# Altium schematic sheet cs301_Group_12.SchDoc
size B; SheetNumber: 1; SheetTotal: 2
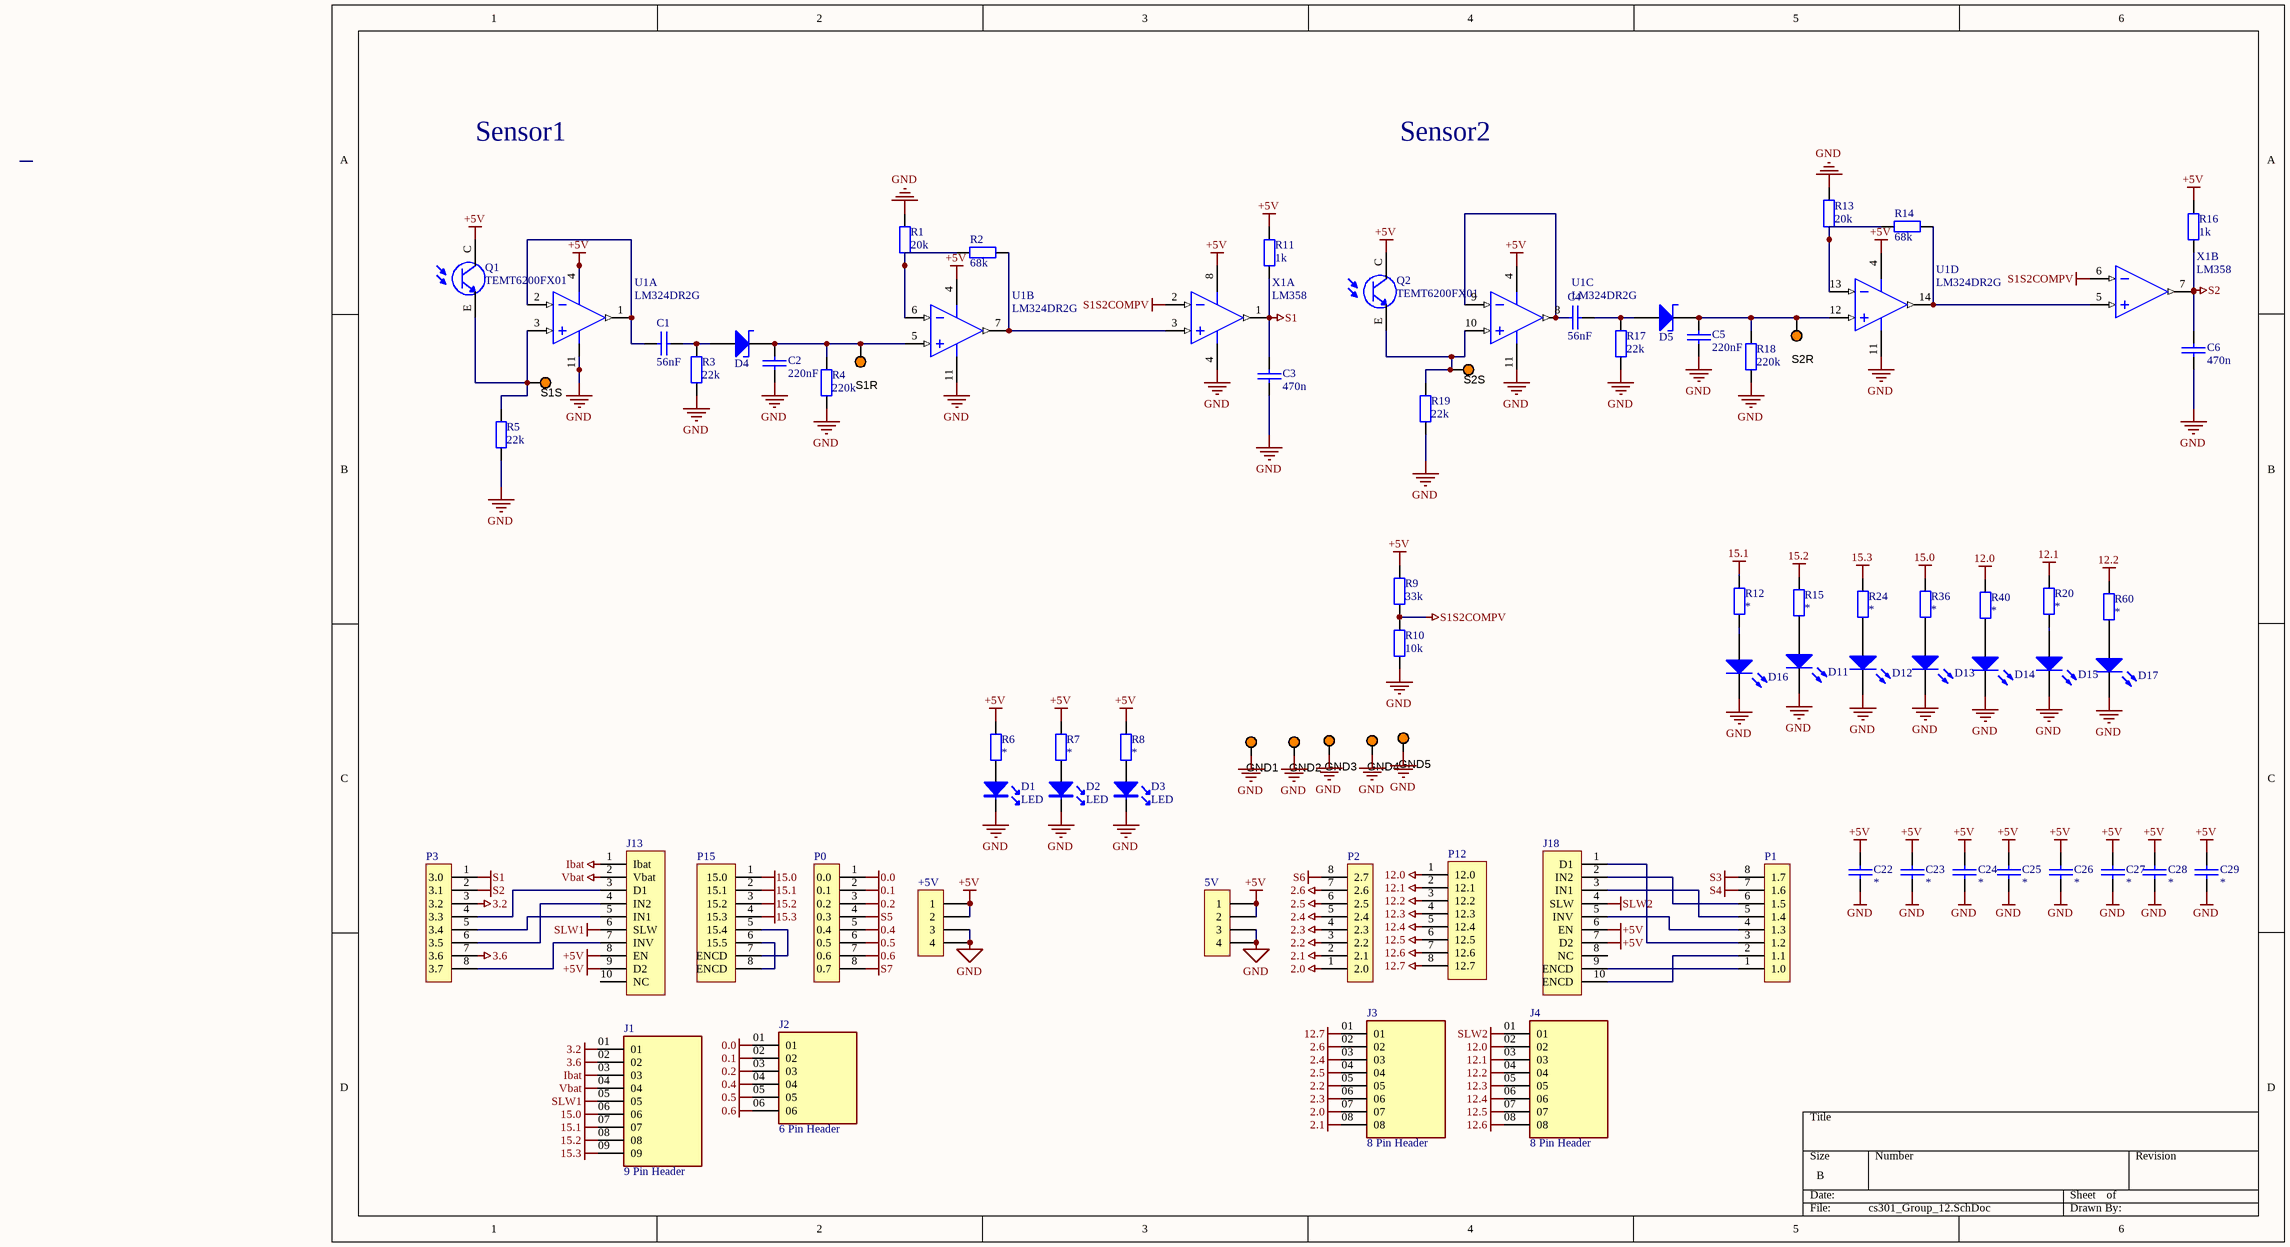
[diagram p0: cs301_Group_12.SchDoc]

## Parts
5V  5V  [IDC4]  (value not drawn)
+5V  5V  [IDC4]  (value not drawn)
C1  56nF  [0805 CAP]
C2  220nF  [0805 CAP]
C3  470n  [0805 CAP]
C4  56nF  [0805 CAP]
C5  220nF  [0805 CAP]
C6  470n  [0805 CAP]
C22  *  [0805 CAP]
C23  *  [0805 CAP]
C24  *  [0805 CAP]
C25  *  [0805 CAP]
C26  *  [0805 CAP]
C27  *  [0805 CAP]
C28  *  [0805 CAP]
C29  *  [0805 CAP]
D1  LED  [LED0.1/5MM]
D2  LED  [LED0.1/5MM]
D3  LED  [LED0.1/5MM]
D4  BZT52H-B4V7  [SOD123]  (value not drawn)
D5  BZT52H-B4V7  [SOD123]  (value not drawn)
D11  LTST-C170KGKT  [0805 LED]  (value not drawn)
D12  LTST-C170KGKT  [0805 LED]  (value not drawn)
D13  LTST-C170KGKT  [0805 LED]  (value not drawn)
D14  LTST-C170KGKT  [0805 LED]  (value not drawn)
D15  LTST-C170KGKT  [0805 LED]  (value not drawn)
D16  LTST-C170KGKT  [0805 LED]  (value not drawn)
D17  LTST-C170KGKT  [0805 LED]  (value not drawn)
GND1  5003  [TP_TH]  (value not drawn)
GND2  5003  [TP_TH]  (value not drawn)
GND3  5003  [TP_TH]  (value not drawn)
GND4  5003  [TP_TH]  (value not drawn)
GND5  5003  [TP_TH]  (value not drawn)
J1  9 Pin Header  [SAMTEC_MTSW-109-22-G-S-440]
J2  6 Pin Header  [SAMTEC_TSW-106-07-H-S]
J3  8 Pin Header  [SAMTEC_TSW-108-05-F-S]
J4  8 Pin Header  [SAMTEC_TSW-108-05-F-S]
J13  CON10  [idc10]  (value not drawn)
J18  CON10  [IDC10]  (value not drawn)
P0  P0  [idc8]  (value not drawn)
P1  P1  [idc8]  (value not drawn)
P2  P2  [idc8]  (value not drawn)
P3  P3  [idc8]  (value not drawn)
P12  P12  [idc8]  (value not drawn)
P15  P15  [idc8]  (value not drawn)
Q1  TEMT6200FX01  [XDCR_TEMT6200FX01]
Q2  TEMT6200FX01  [XDCR_TEMT6200FX01]
R1  20k  [0805 RES]
R2  68k  [0805 RES]
R3  22k  [0805 RES]
R4  220k  [0805 RES]
R5  22k  [0805 RES]
R6  *  [0805 RES]
R7  *  [0805 RES]
R8  *  [0805 RES]
R9  33k  [0805 RES]
R10  10k  [0805 RES]
R11  1k  [0805 RES]
R12  *  [0805 RES]
R13  20k  [0805 RES]
R14  68k  [0805 RES]
R15  *  [0805 RES]
R16  1k  [0805 RES]
R17  22k  [0805 RES]
R18  220k  [0805 RES]
R19  22k  [0805 RES]
R20  *  [0805 RES]
R24  *  [0805 RES]
R36  *  [0805 RES]
R40  *  [0805 RES]
R60  *  [0805 RES]
S1R  5003  [TP_TH]  (value not drawn)
S1S  5003  [TP_TH]  (value not drawn)
S2R  5003  [TP_TH]  (value not drawn)
S2S  5003  [TP_TH]  (value not drawn)
U1  LM324DR2G  [SOIC-14]  (parts A,B,C,D of 4)
X1  LM358  [SO - 8]  (parts A,B of 2)

## Nets
0.0: J2.01 P0.1(0.0)
0.1: J2.02 P0.2(0.1)
0.2: J2.03 P0.3(0.2)
0.4: J2.04 P0.5(0.4)
0.5: J2.05 P0.6(0.5)
0.6: J2.06 P0.7(0.6)
2.0: J3.07 P2.1(2.0)
2.1: J3.08 P2.2(2.1)
2.2: J3.05 P2.3(2.2)
2.3: J3.06 P2.4(2.3)
2.4: J3.03 P2.5(2.4)
2.5: J3.04 P2.6(2.5)
2.6: J3.02 P2.7(2.6)
3.2: J1.01 P3.3(3.2)
3.6: J1.02 P3.7(3.6)
12.0: J4.02 P12.1(12.0) R40.2
12.1: J4.03 P12.2(12.1) R20.2
12.2: J4.04 P12.3(12.2) R60.2
12.3: J4.05 P12.4(12.3)
12.4: J4.06 P12.5(12.4)
12.5: J4.07 P12.6(12.5)
12.6: J4.08 P12.7(12.6)
12.7: J3.01 P12.8(12.7)
15.0: J1.06 P15.1(15.0) R36.2
15.1: J1.07 P15.2(15.1) R12.2
15.2: J1.08 P15.3(15.2) R15.2
15.3: J1.09 P15.4(15.3) R24.2
+5V: 5V.1 5V.2 +5V.1 +5V.2 C22.1 C23.1 C24.1 C25.1 C26.1 C27.1 C28.1 C29.1 J13.8(EN) J13.9(D2) J18.6(EN) J18.7(D2) Q1.C Q2.C R6.2 R7.2 R8.2 R9.1 R11.1 R16.1 U1.4(VCC) X1.8(VDD)
GND: 5V.3 5V.4 +5V.3 +5V.4 C2.2 C3.2 C5.2 C6.2 C22.2 C23.2 C24.2 C25.2 C26.2 C27.2 C28.2 C29.2 D1.K D2.K D3.K D11.2(K) D12.2(K) D13.2(K) D14.2(K) D15.2(K) D16.2(K) D17.2(K) R1.2 R3.1 R4.1 R5.1 R10.2 R13.2 R17.1 R18.1 R19.1 U1.11(VEE/GND) X1.4(VSS)
Ibat: J1.03 J13.1(Ibat)
S1: C3.1 P3.1(3.0) R11.2 X1.1(VOUTA)
S1S2COMPV: R9.2 R10.1 X1.2(VINA-) X1.6(VINA-)
S2: C6.1 P3.2(3.1) R16.2 X1.7(VOUTA)
S3: P1.8(1.7)
S4: P1.7(1.6)
S5: P0.4(0.3)
S6: P2.8(2.7)
S7: P0.8(0.7)
SLW1: J1.05 J13.6(SLW)
SLW2: J4.01 J18.4(SLW)
Vbat: J1.04 J13.2(Vbat)
NetC1_1: C1.1 U1.1(OUT1) U1.2(IN1-)
NetC1_2: C1.2 D4.1(A) R3.2
NetC2_1: C2.1 D4.2(K) R4.2 S1R.1 U1.5(IN2+)
NetC4_1: C4.1 U1.8(OUT3) U1.9(IN3-)
NetC4_2: C4.2 D5.1(A) R17.2
NetC5_1: C5.1 D5.2(K) R18.2 S2R.1 U1.12(IN4+)
NetD1_A: D1.A R6.1
NetD2_A: D2.A R7.1
NetD3_A: D3.A R8.1
NetD11_1: D11.1(A) R15.1
NetD12_1: D12.1(A) R24.1
NetD13_1: D13.1(A) R36.1
NetD14_1: D14.1(A) R40.1
NetD15_1: D15.1(A) R20.1
NetD16_1: D16.1(A) R12.1
NetD17_1: D17.1(A) R60.1
NetJ13_3: J13.3(D1) P3.4(3.3)
NetJ13_4: J13.4(IN2) P3.6(3.5)
NetJ13_5: J13.5(IN1) P3.5(3.4)
NetJ13_7: J13.7(INV) P3.8(3.7)
NetJ18_1: J18.1(D1) P1.3(1.2)
NetJ18_2: J18.2(IN2) P1.6(1.5)
NetJ18_3: J18.3(IN1) P1.5(1.4)
NetJ18_5: J18.5(INV) P1.4(1.3)
NetJ18_9: J18.9(ENCD) P1.1(1.0)
NetJ18_10: J18.10(ENCD) P1.2(1.1)
NetP15_5: P15.5(15.4) P15.7(ENCD)
NetP15_6: P15.6(15.5) P15.8(ENCD)
NetQ1_E: Q1.E R5.2 S1S.1 U1.3(IN1+)
NetQ2_E: Q2.E R19.2 S2S.1 U1.10(IN3+)
NetR1_1: R1.1 R2.2 U1.6(IN2-)
NetR2_1: R2.1 U1.7(OUT2) X1.3(VINA+)
NetR13_1: R13.1 R14.2 U1.13(IN4-)
NetR14_1: R14.1 U1.14(OUT4) X1.5(VINA+)

Not connected (* = marked no-connect by the designer): GND1 1; GND2 1; GND3 1; GND4 1; GND5 1; J13 10(NC); J18 8(NC)

## Notes on the sheet
- Sensor1
- Sensor2
- Labels drawn without touching a wire or pin: GND

## Library data of the parts
5V +5V = CON4: Connector
C1-C6 C22-C29 = CerCap_SMT_0805: SMT ceramic capacitor 0805 size; Value: *
D4 D5 = Zener_SMT_SOD123: SMT zener diode with SOD123 package; Manufacturer: Nexperia USA Inc.; Manufacturer Part Number: BZT52H-B4V7,115; Tolerance: ±2%; Supplier 1: Digi-Key; RoHS: RoHS Compliant; Category: Discrete Semiconductor Products; Stock 1: 0; Pricing 1: 1=0.51, 10=0.408, 100=0.2164, 500=0.14232, 1000=0.09678 (NZD); Packaging: Cut Tape (CT); Part Status: Active; Operating Temperature: -65°C ~ 150°C (TA); Mounting Type: Surface Mount; Package / Case: SOD-123F; Supplier Device Package: SOD-123F; ComponentLink1URL: https://assets.nexperia.com/documents/data-sheet/BZT52H_SER.pdf; ComponentLink1Description: https://assets.nexperia.com/documents/data-sheet/BZT52H_SER.pdf; Supplier Part Number 1: 1727-1611-1-ND
D11-D17 = LED_SMT_0805: SMT LED 0805 size; Manufacturer: Lite-On Inc.; Color: Green; Lens Color: Colorless; Lens Transparency: Clear; Millicandela Rating: 35mcd; Lens Style/Size: Rectangle with Flat Top, 1.40mm x 1.25mm; Voltage - Forward (Vf) (Typ): 2V; Current - Test: 20mA; Viewing Angle: 130°; Wavelength - Dominant: 571nm; Wavelength - Peak: 574nm; Supplier 1: Digi-Key; Manufacturer Part Number: LTST-C170KGKT; RoHS: RoHS Compliant; Category: Optoelectronics; Stock 1: 503069; Pricing 1: 1=0.62, 10=0.459, 25=0.338, 100=0.2415, 250=0.16416, 500=0.14486, 1000=0.11347 (NZD); Packaging: Cut Tape (CT); Part Status: Active; Mounting Type: Surface Mount; Features: -; Package / Case: 0805 (2012 Metric); Size / Dimension: 2.00mm L x 1.25mm W; Height (Max): 1.10mm; ComponentLink1URL: http://optoelectronics.liteon.com/upload/download/DS22-2000-073/LTST-C170KGKT.pdf; ComponentLink1Description: http://optoelectronics.liteon.com/upload/download/DS22-2000-073/LTST-C170KGKT.pdf; Supplier Part Number 1: 160-1414-1-ND
GND1-GND5 S1R S1S S2R S2S = TestPoint: Test Point, Orange, 1-Pin THD, RoHS; Peak Reverse Current: 600 uA; Forward Current: 3 A; Max Surge Current: 80 A; Forward Voltage: 1.08 V; Max Operating Temperature: 150 degC; PackageReference: 5003; Pins: 2; ComponentLink2URL: http://keyelco.com/userAssets/file/M65p56.pdf; PackageDescription: 1-Pin Through Hole Device, Dia 2.54 mm; Weight: 0.01 lb; Diameter: 5.3 mm; Mount: Through Hole; Package Quantity: 500; Packaging: Bulk; Min Operating Temperature: -65 degC; ComponentLink1Description: Manufacturer URL; Height: 0.25 inch; ComponentLink1URL: http://www.keyelco.com/; ComponentLink2Description: Datasheet; Width: 0.25 inch; REACH SVHC: No SVHC; RoHSCompliant: true; Radiation Hardening: No; Length: 9.5 mm; DatasheetVersion: Jun-15
J1 = MTSW-109-22-G-S-440: MP: MTSW-109-22-G-S-440; Availability: Unavailable; Package: None; Price: None; Value: *
J2 = TSW-106-07-H-S: Connector Header Through Hole 6 position 0.100 (2.54mm); MF: Samtec; Value: *; MP: TSW-106-07-H-S; Package: None; Purchase-URL: https://pricing.snapeda.com/search/part/TSW-106-07-H-S/?ref=eda; Availability: In Stock; Check_prices: https://www.snapeda.com/parts/TSW-106-07-H-S/Samtec/view-part/?ref=eda; SnapEDA_Link: https://www.snapeda.com/parts/TSW-106-07-H-S/Samtec/view-part/?ref=snap; Price: None
J3 J4 = TSW-108-05-F-S: Package: None; Price: None; Value: *; MP: TSW-108-05-F-S; Availability: Unavailable
J13 J18 = CON10: Connector
P0-P3 = CON8: Connector
P12 P15 = CON8_1: Connector
Q1 Q2 = TEMT6200FX01: Phototransistors 550nm Top View 0805 (2012 Metric); MF: Vishay Semiconductor; Price: None; Package: 0805 Vishay Semiconductor; Check_prices: https://www.snapeda.com/parts/TEMT6200FX01/Vishay%20Semiconductor%20Opto%20Division/view-part/43955/?ref=eda; Purchase-URL: https://pricing.snapeda.com/search/part/TEMT6200FX01/?ref=eda; MP: TEMT6200FX01; Value: *; SnapEDA_Link: https://www.snapeda.com/parts/TEMT6200FX01/Vishay%20Semiconductor%20Opto%20Division/view-part/43955/?ref=snap; Availability: Good
R1-R20 R24 R36 R40 R60 = Res_SMT_0805: 0805 resistor; Published: 8-Jun-2000; LatestRevisionDate: 17-Jul-2002; LatestRevisionNote: Re-released for DXP Platform.; PackageReference: AXIAL-0.4; Publisher: Altium Limited; Value: *; ComponentLink1Description: https://nz.mouser.com/datasheet/2/315/AOA0000C304-1149620.pdf
U1 = LM324DR_SMT_SOIC16: Single Supply Quad Operational Amplifier, 3 to 32 V, 0 to 70 degC, 14-Pin SOIC, Pb-Free, Tape and Reel; Manufacturer: On Semiconductor; VCC Max (V): 32; VCC Min (V): 3; PackageVersion: Rev. K, 05/2011; ComponentLink3URL: http://www.onsemi.com/pub_link/Collateral/751A-03.PDF; ComponentLink3Description: Package Specification; Packing: Tape and Reel; ComponentLink2URL: http://www.onsemi.cn/pub_link/Collateral/LM324-D.PDF; PackageReference: SOIC-14-751A-03; ComponentLink1URL: http://www.onsemi.com/; PackageDescription: 14-Pin Small Outline Integrated Circuit, Body 8.65 x 3.9 mm, Pitch 1.27 mm; ComponentLink1Description: Manufacturer URL; DatasheetVersion: Rev. 25; Mounting Technology: Surface Mount; RoHS: TRUE; ComponentLink2Description: Datasheet; PartNumber: LM324DR2G
X1 = LM358_SMT_SOIC8: IC OPAMP 8SOIC; ComponentLink1URL: http://www.ti.com/lit/ds/symlink/tlc080a.pdf; ComponentLink1Description: http://www.ti.com/lit/ds/symlink/tlc080a.pdf; Supplier 1: Digi-Key; Supplier Part Number 1: 296-1014-1-ND